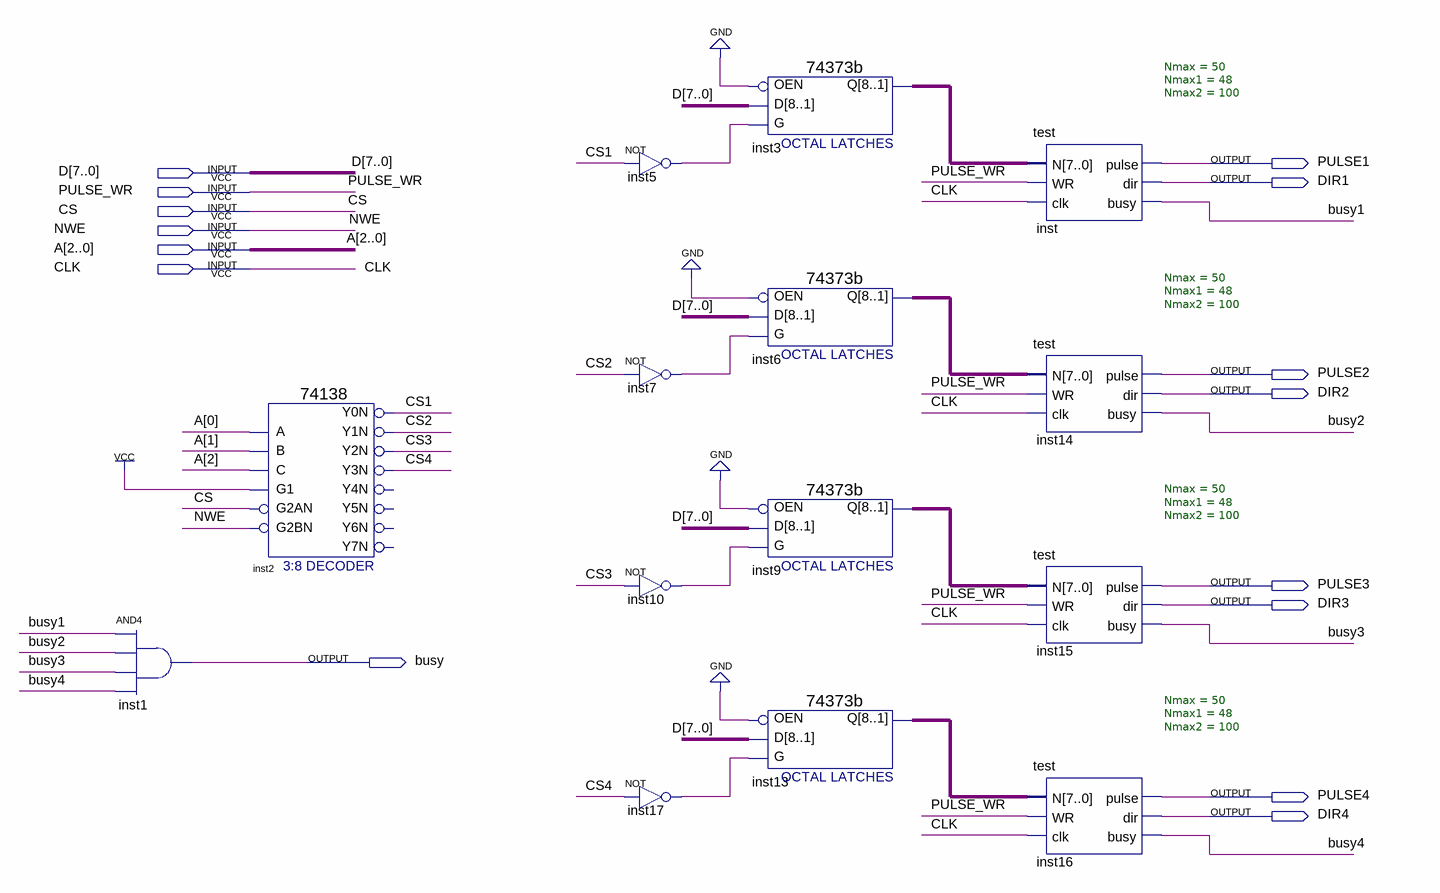
[diagram p0: schematic sheet]
// Quartus schematic DDA.bdf as structural Verilog: 14 symbols, 15 pins
module DDA (
  input  [7:0] D,
  input  PULSE_WR,
  input  CS,
  input  NWE,
  input  [2:0] A,
  input  CLK,
  output PULSE1,
  output DIR1,
  output PULSE2,
  output DIR2,
  output PULSE3,
  output DIR3,
  output busy,
  output PULSE4,
  output DIR4
);

  wire busy1, busy2, busy3, busy4, CS1, CS2, CS3, CS4, inst5_out, inst7_out, inst10_out, inst17_out;
  wire [7:0] inst3_q, inst6_q, inst9_q, inst13_q;

  and inst1 (busy, busy1, busy2, busy3, busy4);
  \74138  inst2 (
    .A(A[0]), .B(A[1]), .G1(1'b1), .C(A[2]), .G2AN(CS), .G2BN(NWE), .Y0N(CS1), .Y1N(CS2), .Y2N(CS3), .Y3N(CS4));  // open: Y4N, Y5N, Y6N, Y7N
  not inst5 (inst5_out, CS1);
  not inst7 (inst7_out, CS2);
  not inst10 (inst10_out, CS3);
  not inst17 (inst17_out, CS4);
  \74373b  inst3 (.D(D), .G(inst5_out), .OEN(1'b0), .Q(inst3_q));
  \74373b  inst6 (.D(D), .G(inst7_out), .OEN(1'b0), .Q(inst6_q));
  \74373b  inst9 (.D(D), .G(inst10_out), .OEN(1'b0), .Q(inst9_q));
  \74373b  inst13 (.D(D), .G(inst17_out), .OEN(1'b0), .Q(inst13_q));
  test #(.Nmax(50), .Nmax1(48), .Nmax2(100)) inst (
    .N(inst3_q), .WR(PULSE_WR), .clk(CLK), .pulse(PULSE1), .dir(DIR1), .busy(busy1));
  test #(.Nmax(50), .Nmax1(48), .Nmax2(100)) inst14 (
    .N(inst6_q), .WR(PULSE_WR), .clk(CLK), .pulse(PULSE2), .dir(DIR2), .busy(busy2));
  test #(.Nmax(50), .Nmax1(48), .Nmax2(100)) inst15 (
    .N(inst9_q), .WR(PULSE_WR), .clk(CLK), .pulse(PULSE3), .dir(DIR3), .busy(busy3));
  test #(.Nmax(50), .Nmax1(48), .Nmax2(100)) inst16 (
    .N(inst13_q), .WR(PULSE_WR), .clk(CLK), .pulse(PULSE4), .dir(DIR4), .busy(busy4));
endmodule
